# Altium schematic sheet led-pb-wing.SchDoc: Posedge LED-PushButton Wing
size A4; Organization: www.posedge.ir; Address1: Rayan-Sanat Tech.; Address2: Isfahan Science and; Address3: Technology Town, Isfahan; Address4: IRAN
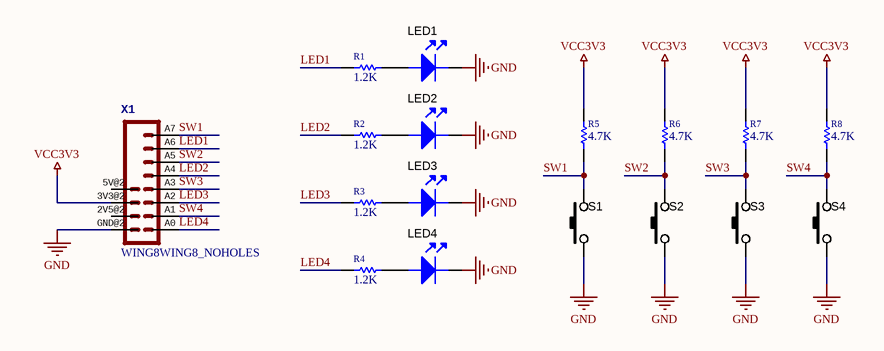
[diagram p0: led-pb-wing.SchDoc]

## Parts
LED1  (no value)  [LED_0805]
LED2  (no value)  [LED_0805]
LED3  (no value)  [LED_0805]
LED4  (no value)  [LED_0805]
R1  1.2K  [R0805_M]
R2  1.2K  [R0805_M]
R3  1.2K  [R0805_M]
R4  1.2K  [R0805_M]
R5  4.7K  [R0805_M]
R6  4.7K  [R0805_M]
R7  4.7K  [R0805_M]
R8  4.7K  [R0805_M]
S1  USER PB  [TS645S]  (value not drawn)
S2  USER PB  [TS645S]  (value not drawn)
S3  USER PB  [TS645S]  (value not drawn)
S4  USER PB  [TS645S]  (value not drawn)
X1  WING8WING8_NOHOLES  [WINGSIDE_8BIT_NOHOLES]

## Nets
GND: LED1.1(cathode) LED2.1(cathode) LED3.1(cathode) LED4.1(cathode) S1.1 S2.1 S3.1 S4.1 X1.GND@2(GND)
VCC3V3: R5.2 R6.2 R7.2 R8.2 X1.3V3@2(3V3)
LED1: R1.2 X1.A6
LED2: R2.2 X1.A4
LED3: R3.2 X1.A2
LED4: R4.2 X1.A0
SW1: R5.1 S1.2 X1.A7
SW2: R6.1 S2.2 X1.A5
SW3: R7.1 S3.2 X1.A3
SW4: R8.1 S4.2 X1.A1
NetLED1_2: LED1.2(ANODE) R1.1
NetLED2_2: LED2.2(ANODE) R2.1
NetLED3_2: LED3.2(ANODE) R3.1
NetLED4_2: LED4.2(ANODE) R4.1

Not connected (* = marked no-connect by the designer): X1 2V5@2(2V5) 5V@2(5V)

## Notes on the sheet
- Title
- Size:
- Date:
- A4
- Number:
- Revision:
- Sheet
- of

## Library data of the parts
LED1-LED4 = LED_0805: LED, 0805 SMD; Manufacturer 1: LITE-ON; Manufacturer Part Number 1: LTST-C171GKT; Material: GaP; Ratings: 6 mcd; 569 nm; SCDType: source; Package / Case: 0805; Supplier 1: Digi-Key; Supplier Part Number 1: 160-1423-1-ND; Value: =Color
R1-R8 = R0805: Chip Resistor size 0805
  R1-R4: Value: 1.2K
  R5-R8: Value: 4.7K
S1-S4 = SW_SMD_4Pin: SMT Tactile Switch (6mm x 6mm); Manufacturer 1: Bond-Tact; Manufacturer Part Number 1: TS-1143S-WP-200; SCDType: spec; Function: On/Off; Package / Case: 6.5x6.5mm; 4.3mm stem